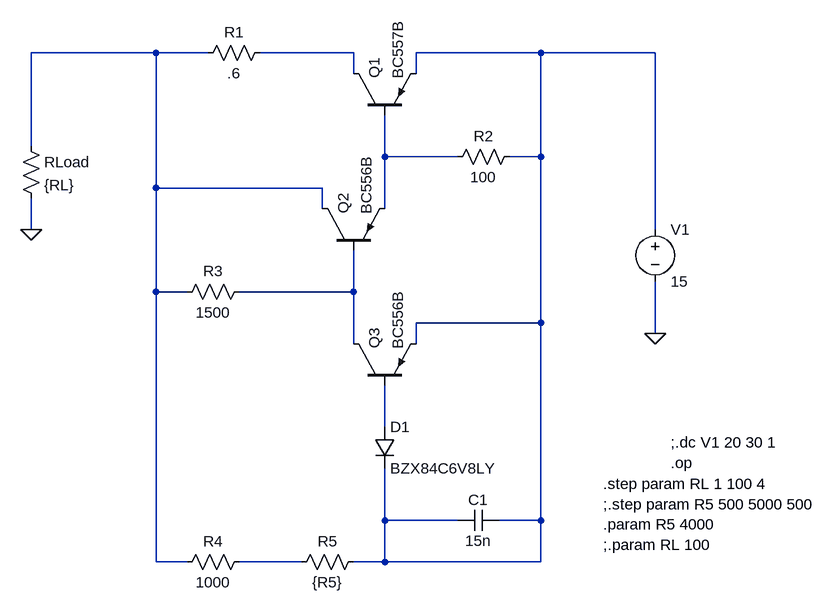
[diagram p0: schematic CurrentLimiter-03.asc]
CurrentLimiter-03.asc, the LTspice schematic file:
Version 4.1
SHEET 1 1192 896
WIRE -144 64 -336 64
WIRE -64 64 -144 64
WIRE 160 64 16 64
WIRE 448 64 256 64
WIRE 624 64 448 64
WIRE 160 96 160 64
WIRE 256 96 256 64
WIRE -336 208 -336 64
WIRE 208 224 208 160
WIRE 320 224 208 224
WIRE 448 224 448 64
WIRE 448 224 400 224
WIRE -144 272 -144 64
WIRE 112 272 -144 272
WIRE 112 304 112 272
WIRE 208 304 208 224
WIRE -336 336 -336 288
WIRE 624 336 624 64
WIRE -144 432 -144 272
WIRE -96 432 -144 432
WIRE 160 432 160 368
WIRE 160 432 -16 432
WIRE 448 480 448 224
WIRE 448 480 256 480
WIRE 624 496 624 416
WIRE 160 512 160 432
WIRE 256 512 256 480
WIRE 208 640 208 576
WIRE 208 784 208 704
WIRE 320 784 208 784
WIRE 448 784 448 480
WIRE 448 784 384 784
WIRE -144 848 -144 432
WIRE -96 848 -144 848
WIRE 80 848 -16 848
WIRE 208 848 208 784
WIRE 208 848 160 848
WIRE 448 848 448 784
WIRE 448 848 208 848
FLAG 624 496 0
FLAG -336 336 0
SYMBOL pnp 160 160 R270
SYMATTR InstName Q1
SYMATTR Value BC557B
SYMBOL pnp 112 368 R270
SYMATTR InstName Q2
SYMATTR Value BC556B
SYMBOL pnp 160 576 R270
SYMATTR InstName Q3
SYMATTR Value BC556B
SYMBOL res 32 48 R90
WINDOW 0 0 56 VBottom 2
WINDOW 3 32 56 VTop 2
SYMATTR InstName R1
SYMATTR Value .6
SYMBOL res 416 208 R90
WINDOW 0 0 56 VBottom 2
WINDOW 3 32 56 VTop 2
SYMATTR InstName R2
SYMATTR Value 100
SYMBOL res 0 416 R90
WINDOW 0 0 56 VBottom 2
WINDOW 3 32 56 VTop 2
SYMATTR InstName R3
SYMATTR Value 1500
SYMBOL res 0 832 R90
WINDOW 0 0 56 VBottom 2
WINDOW 3 32 56 VTop 2
SYMATTR InstName R4
SYMATTR Value 1000
SYMBOL res 176 832 R90
WINDOW 0 0 56 VBottom 2
WINDOW 3 32 56 VTop 2
SYMATTR InstName R5
SYMATTR Value {R5}
SYMBOL cap 384 768 R90
WINDOW 0 0 32 VBottom 2
WINDOW 3 32 32 VTop 2
SYMATTR InstName C1
SYMATTR Value 15n
SYMBOL diode 192 640 R0
SYMATTR InstName D1
SYMATTR Value BZX84C6V8LY
SYMBOL voltage 624 320 R0
WINDOW 123 0 0 Left 0
WINDOW 39 0 0 Left 0
SYMATTR InstName V1
SYMATTR Value 15
SYMBOL res -352 192 R0
SYMATTR InstName RLoad
SYMATTR Value {RL}
TEXT 544 728 Left 2 !.step param RL 1 100 4\n;.step param R5 500 5000 500\n.param R5 4000\n;.param RL 100
TEXT 648 664 Left 2 !;.dc V1 20 30 1\n.op

The netlist it stands for:
* CurrentLimiter-03.asc
Q1 N002 N004 N003 0 BC557B
Q2 N001 N005 N004 0 BC556B
Q3 N005 N006 N003 0 BC556B
R1 N002 N001 .6
R2 N003 N004 100
R3 N005 N001 1500
R4 N007 N001 1000
R5 N003 N007 {R5}
C1 N003 N003 15n
D1 N006 N003 BZX84C6V8LY
V1 N003 0 15
RLoad N001 0 {RL}
.model D D
.lib standard.dio
.model NPN NPN
.model PNP PNP
.lib standard.bjt
.step param RL 1 100 4
;.step param R5 500 5000 500
.param R5 4000
;.param RL 100
;.dc V1 20 30 1
.op
.backanno
.end